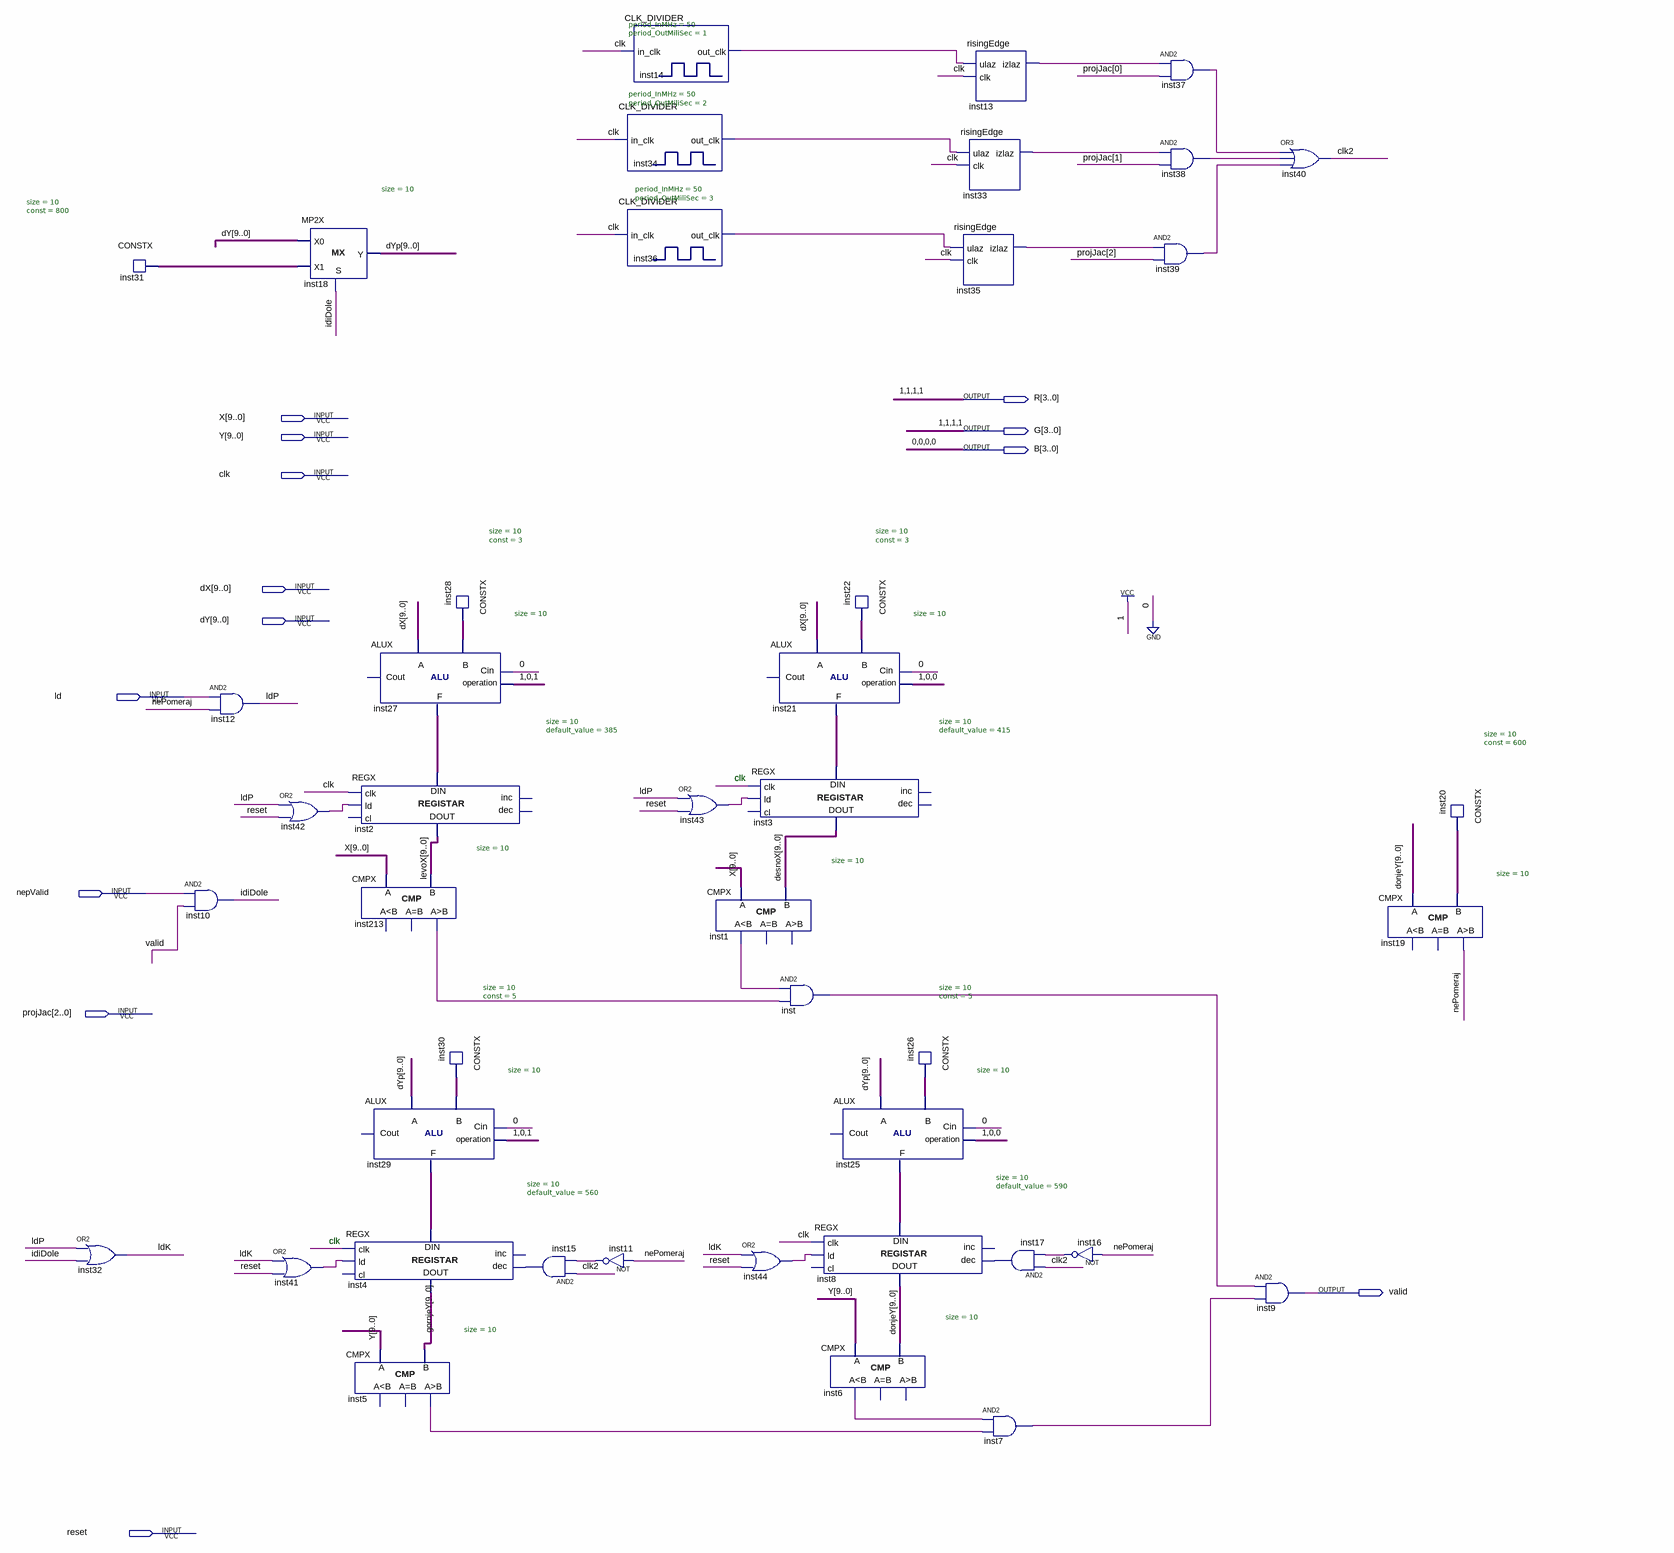
[diagram p0: schematic sheet]
// Quartus schematic projektil.bdf as structural Verilog: 44 symbols, 13 pins
module projektil (
  input  [9:0] X,
  input  [9:0] Y,
  input  clk,
  input  [9:0] dX,
  input  [9:0] dY,
  input  ld,
  input  nepValid,
  input  [2:0] projJac,
  input  reset,
  output [3:0] R,
  output [3:0] G,
  output [3:0] B,
  output valid
);

  wire clk2, idiDole, inst1_ls, inst5_gr, inst6_ls, inst7_out, inst11_out, inst13_izlaz, inst14_out_clk,
       inst15_out, inst16_out, inst17_out, inst33_izlaz, inst34_out_clk, inst35_izlaz, inst36_out_clk,
       inst37_out, inst38_out, inst39_out, inst41_out, inst42_out, inst43_out, inst44_out, inst213_gr,
       inst_out, ldK, ldP, nePomeraj;
  wire [9:0] desnoX, donjeY, dYp, gornjeY, inst20_data, inst21_f, inst22_data, inst25_f, inst26_data,
       inst27_f, inst28_data, inst29_f, inst30_data, inst31_data, levoX;

  CONSTX #(.size(10), .\const (800)) inst31 (.data(inst31_data));
  or inst32 (ldK, ldP, idiDole);
  and inst12 (ldP, ld, nePomeraj);
  and inst10 (idiDole, nepValid, valid);
  MP2X #(.size(10)) inst18 (.S(idiDole), .X0(dY), .X1(inst31_data), .Y(dYp));
  or inst42 (inst42_out, ldP, reset);
  or inst41 (inst41_out, ldK, reset);
  ALUX #(.size(10)) inst27 (.Cin(1'b0), .B(inst28_data), .A(dX), .op(3'b101), .F(inst27_f));  // open: Cout
  REGX #(.size(10), .default_value(385)) inst2 (
    .clk(clk), .ld(inst42_out), .data_in(inst27_f), .data_out(levoX));  // open: cl, inc, dec
  CMPX #(.size(10)) inst213 (.A(X), .B(levoX), .gr(inst213_gr));  // open: ls, eq
  ALUX #(.size(10)) inst29 (.Cin(1'b0), .B(inst30_data), .A(dYp), .op(3'b101), .F(inst29_f));  // open: Cout
  REGX #(.size(10), .default_value(560)) inst4 (
    .clk(clk), .ld(inst41_out), .dec(inst15_out), .data_in(inst29_f), .data_out(gornjeY));  // open: cl, inc
  CMPX #(.size(10)) inst5 (.A(Y), .B(gornjeY), .gr(inst5_gr));  // open: ls, eq
  CONSTX #(.size(10), .\const (3)) inst28 (.data(inst28_data));
  CONSTX #(.size(10), .\const (5)) inst30 (.data(inst30_data));
  and inst15 (inst15_out, clk2, inst11_out);
  CLK_DIVIDER #(.period_InMHz(50), .period_OutMiliSec(1)) inst14 (.in_clk(clk), .out_clk(inst14_out_clk));
  CLK_DIVIDER #(.period_InMHz(50), .period_OutMiliSec(2)) inst34 (.in_clk(clk), .out_clk(inst34_out_clk));
  CLK_DIVIDER #(.period_InMHz(50), .period_OutMiliSec(3)) inst36 (.in_clk(clk), .out_clk(inst36_out_clk));
  not inst11 (inst11_out, nePomeraj);
  or inst43 (inst43_out, ldP, reset);
  CMPX #(.size(10)) inst1 (.A(X), .B(desnoX), .ls(inst1_ls));  // open: eq, gr
  ALUX #(.size(10)) inst21 (.Cin(1'b0), .B(inst22_data), .A(dX), .op(3'b100), .F(inst21_f));  // open: Cout
  REGX #(.size(10), .default_value(415)) inst3 (
    .clk(clk), .ld(inst43_out), .data_in(inst21_f), .data_out(desnoX));  // open: cl, inc, dec
  or inst44 (inst44_out, ldK, reset);
  and inst (inst_out, inst1_ls, inst213_gr);
  REGX #(.size(10), .default_value(590)) inst8 (
    .clk(clk), .ld(inst44_out), .dec(inst17_out), .data_in(inst25_f), .data_out(donjeY));  // open: cl, inc
  CMPX #(.size(10)) inst6 (.A(Y), .B(donjeY), .ls(inst6_ls));  // open: eq, gr
  CONSTX #(.size(10), .\const (3)) inst22 (.data(inst22_data));
  ALUX #(.size(10)) inst25 (.Cin(1'b0), .B(inst26_data), .A(dYp), .op(3'b100), .F(inst25_f));  // open: Cout
  CONSTX #(.size(10), .\const (5)) inst26 (.data(inst26_data));
  risingEdge inst13 (.ulaz(inst14_out_clk), .clk(clk), .izlaz(inst13_izlaz));
  risingEdge inst33 (.ulaz(inst34_out_clk), .clk(clk), .izlaz(inst33_izlaz));
  risingEdge inst35 (.ulaz(inst36_out_clk), .clk(clk), .izlaz(inst35_izlaz));
  and inst17 (inst17_out, clk2, inst16_out);
  and inst7 (inst7_out, inst6_ls, inst5_gr);
  not inst16 (inst16_out, nePomeraj);
  and inst37 (inst37_out, inst13_izlaz, projJac[0]);
  and inst38 (inst38_out, inst33_izlaz, projJac[1]);
  and inst39 (inst39_out, inst35_izlaz, projJac[2]);
  or inst40 (clk2, inst37_out, inst38_out, inst39_out);
  and inst9 (valid, inst_out, inst7_out);
  CMPX #(.size(10)) inst19 (.A(donjeY), .B(inst20_data), .gr(nePomeraj));  // open: ls, eq
  CONSTX #(.size(10), .\const (600)) inst20 (.data(inst20_data));

  assign B = 4'b0000;
  assign G = 4'b1111;
  assign R = 4'b1111;

  // Notes on the sheet:
  //   clk
  //   clk
endmodule
